# EAGLE design rcl_mini_v0.1 (EAGLE 8.0.1)
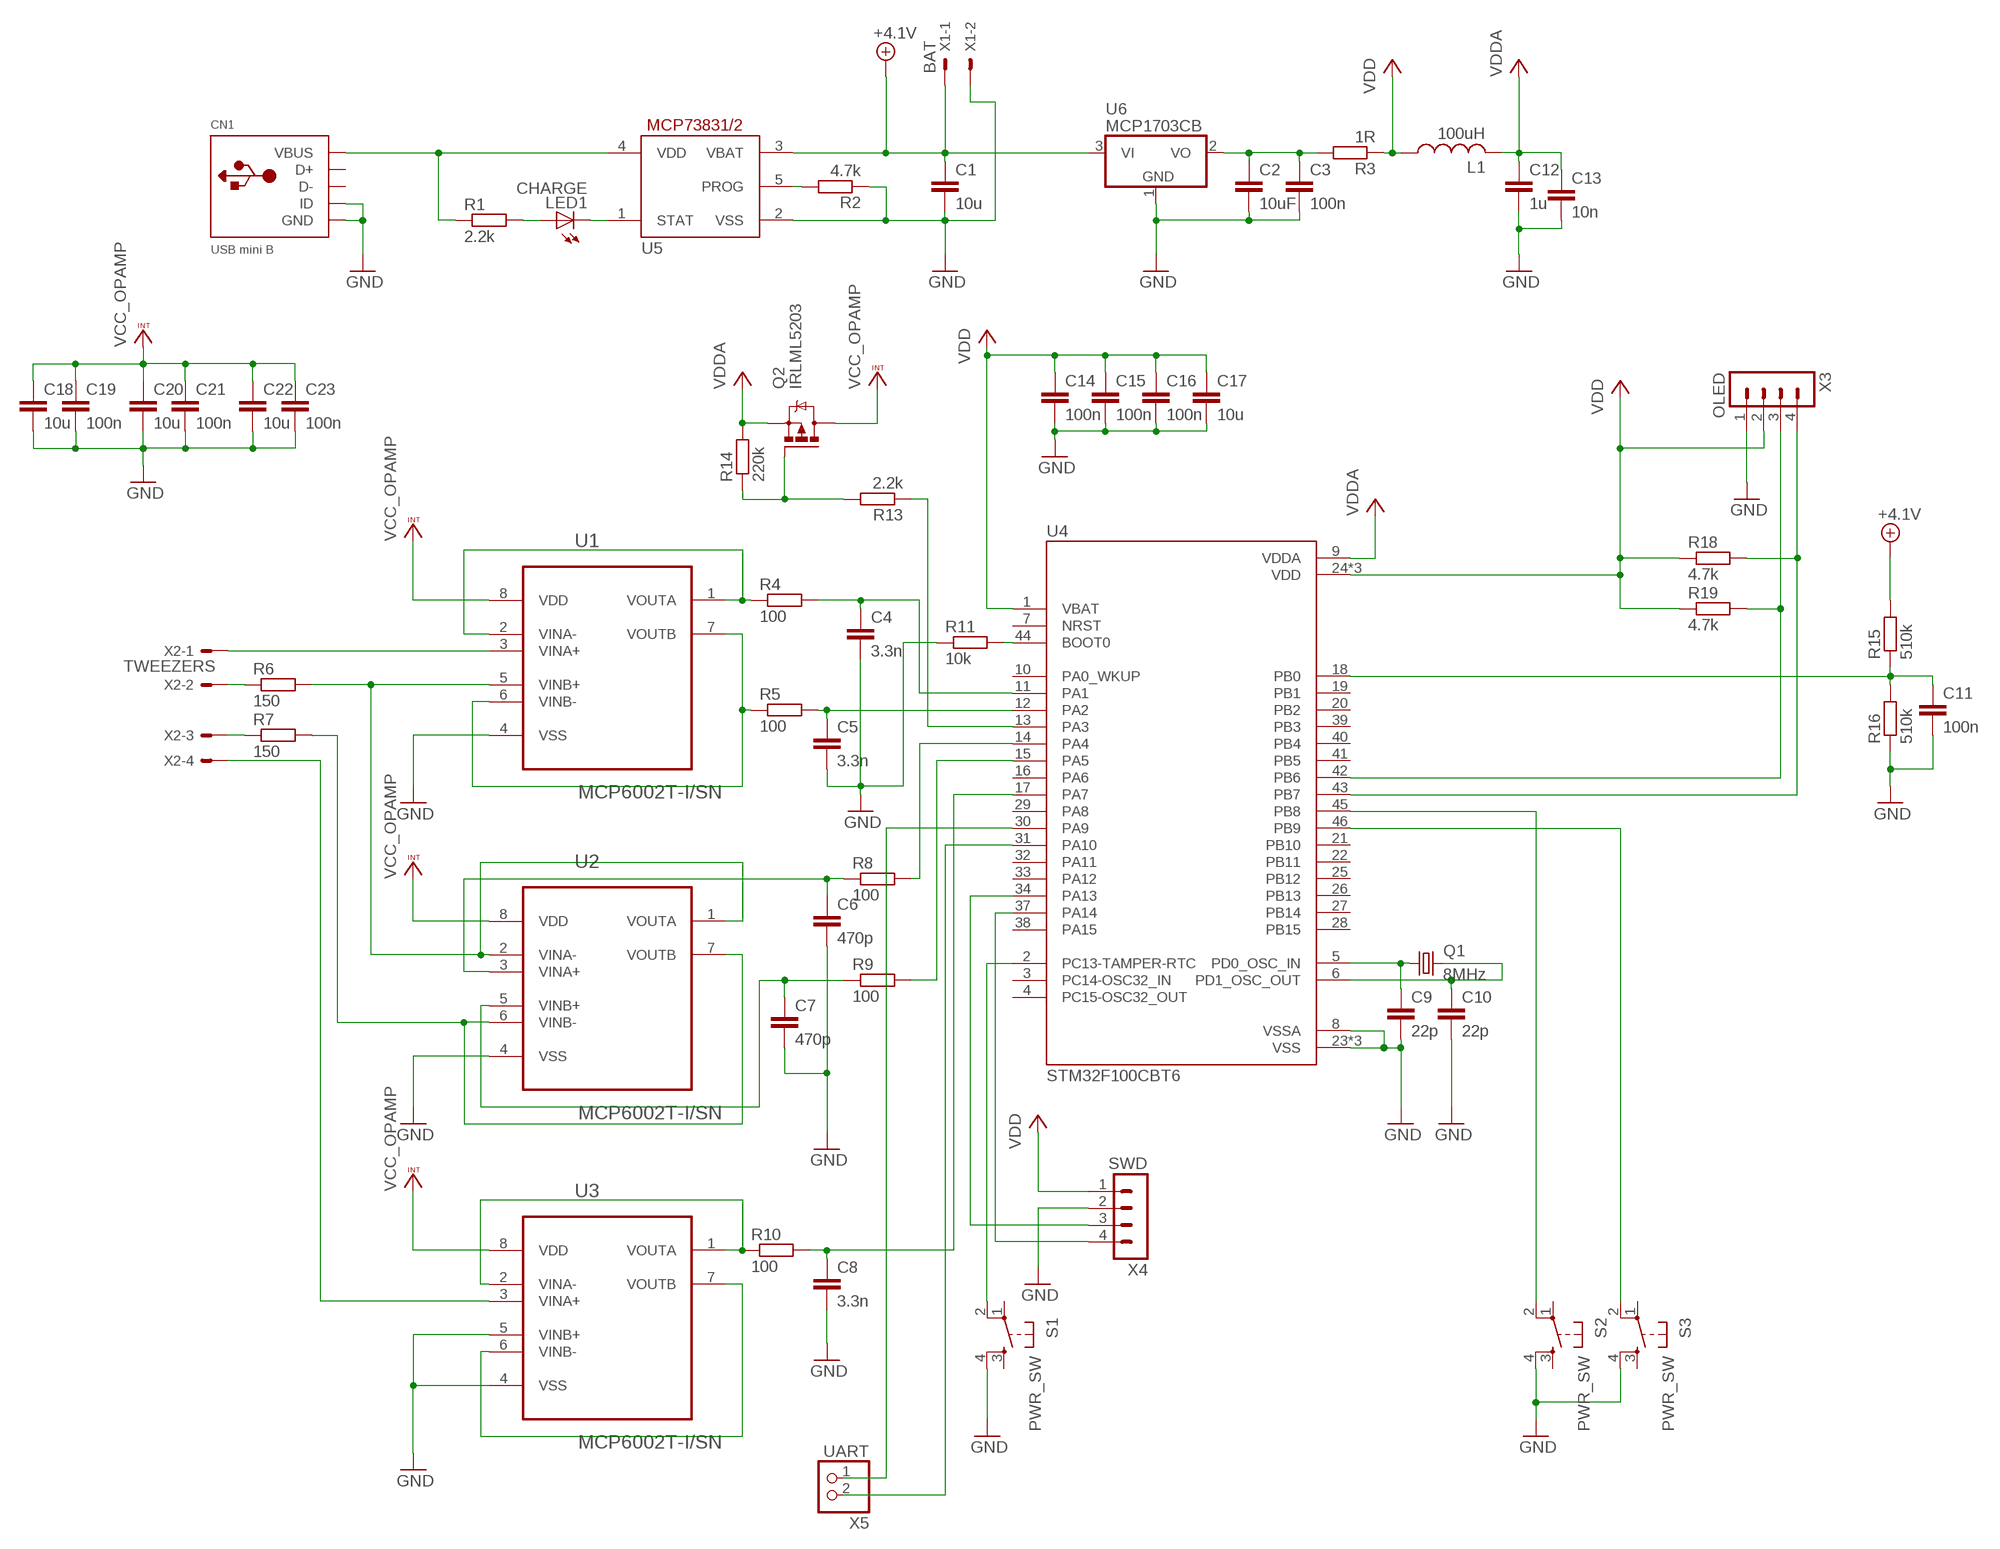
[diagram p0: schematic, sheet 1]

## Parts
C1  10u  C-EUC0805  [C0805]
C2  10uF  C-EUC0805  [C0805]
C3  100n  C-EUC0805  [C0805]
C4  3.3n  C-EUC0805  [C0805]
C5  3.3n  C-EUC0805  [C0805]
C6  470p  C-EUC0805  [C0805]
C7  470p  C-EUC0805  [C0805]
C8  3.3n  C-EUC0805  [C0805]
C9  22p  C-EUC0805  [C0805]
C10  22p  C-EUC0805  [C0805]
C11  100n  C-EUC0805  [C0805]
C12  1u  C-EUC0805  [C0805]
C13  10n  C-EUC0805  [C0805]
C14  100n  C-EUC0805  [C0805]
C15  100n  C-EUC0805  [C0805]
C16  100n  C-EUC0805  [C0805]
C17  10u  C-EUC0805  [C0805]
C18  10u  C-EUC0805  [C0805]
C19  100n  C-EUC0805  [C0805]
C20  10u  C-EUC0805  [C0805]
C21  100n  C-EUC0805  [C0805]
C22  10u  C-EUC0805  [C0805]
C23  100n  C-EUC0805  [C0805]
CN1  USB mini B  USBMINIB  [USB-MINIB]
L1  100uH  L-USL3216C  [L3216C]
LED1  CHARGE  LEDCHIPLED_1206  [CHIPLED_1206]
Q1  8MHz  CRYSTALHC49UP  [HC49UP]
Q2  IRLML5203  [MICRO3]
R1  2.2k  R-EU_M0805  [M0805]
R2  4.7k  R-EU_M0805  [M0805]
R3  1R  R-EU_M0805  [M0805]
R4  100  R-EU_M0805  [M0805]
R5  100  R-EU_M0805  [M0805]
R6  150  R-EU_M0805  [M0805]
R7  150  R-EU_M0805  [M0805]
R8  100  R-EU_M0805  [M0805]
R9  100  R-EU_M0805  [M0805]
R10  100  R-EU_M0805  [M0805]
R11  10k  R-EU_M0805  [M0805]
R13  2.2k  R-EU_M0805  [M0805]
R14  220k  R-EU_M0805  [M0805]
R15  510k  R-EU_M0805  [M0805]
R16  510k  R-EU_M0805  [M0805]
R18  4.7k  R-EU_M0805  [M0805]
R19  4.7k  R-EU_M0805  [M0805]
S1  PWR_SW  DTS-6  [DTS-6]
S2  PWR_SW  DTS-6  [DTS-6]
S3  PWR_SW  DTS-6  [DTS-6]
U1  MCP6002T-I/SN  MCP6002T-I/MS  [SOP65P490X110-8N]
U2  MCP6002T-I/SN  MCP6002T-I/MS  [SOP65P490X110-8N]
U3  MCP6002T-I/SN  MCP6002T-I/MS  [SOP65P490X110-8N]
U4  STM32F100CBT6  STM32F103C8T6  [QFP50P900X900X160-48N]
U5  MCP73831/OT  [SOT23-5L]
U6  MCP1703CB  [SOT23]
UART  X5  PINHD-1X2  [1X02]
X1  BAT  22-23-2021  [22-23-2021]
X2  TWEEZERS  22-23-2041  [22-23-2041]
X3  OLED  MA04-1  [MA04-1]
X4  SWD  MA04-1  [MA04-1]

## Nets
GND [power]: C1.2 C2.2 C3.2 C4.2 C5.2 C6.2 C7.2 C8.2 C9.2 C10.2 C11.2 C12.2 C13.2 C14.2 C15.2 C16.2 C17.2 C18.2 C19.2 C20.2 C21.2 C22.2 C23.2 CN1.GND CN1.ID R2.1 R11.1 R16.1 S1.4 S2.4 S3.4 U1.4(VSS) U2.4(VSS) U3.4(VSS) U3.5(VINB+) U4.8(VSSA) U4.23(VSS) U4.35(VSS) U4.47(VSS) U5.2(VSS) U6.1(GND) X1.2 X3.1 X4.2
HCUR: R7.1 X2.3
HCUR2: R7.2 U2.6(VINB-) U2.7(VOUTB)
HPOT: U3.3(VINA+) X2.4
LCUR: R6.1 X2.2
LCUR2: R6.2 U1.5(VINB+) U2.1(VOUTA) U2.2(VINA-)
LPOT: U1.3(VINA+) X2.1
N$2: LED1.A R1.2
N$3: LED1.C U5.1(STAT)
N$4: R2.2 U5.5(PROG)
N$5: C2.1 C3.1 R3.2 U6.2(VO)
N$6: R4.1 U1.1(VOUTA) U1.2(VINA-)
N$10: R5.1 U1.6(VINB-) U1.7(VOUTB)
N$11: C6.1 R8.1 U2.3(VINA+)
N$12: R11.2 U4.44(BOOT0)
N$15: Q2.1(G) R13.2 R14.1
N$16: C7.1 R9.1 U2.5(VINB+)
N$19: R10.1 U3.1(VOUTA) U3.2(VINA-)
N$20: C11.1 R15.1 R16.2 U4.18(PB0)
N$21: U3.6(VINB-) U3.7(VOUTB)
N$23: C9.1 Q1.1 U4.5(PD0_OSC_IN)
N$24: C10.1 Q1.2 U4.6(PD1_OSC_OUT)
OLED_I2C_SCK: R19.2 U4.42(PB6) X3.3
OLED_I2C_SDA: R18.2 U4.43(PB7) X3.4
PA1: C4.1 R4.2 U4.11(PA1)
PA2: C5.1 R5.2 U4.12(PA2)
PA3: R13.1 U4.13(PA3)
PA4: R8.2 U4.14(PA4)
PA5: R9.2 U4.15(PA5)
PA7: C8.1 R10.2 U4.17(PA7)
SW1: S1.2 U4.2(PC13-TAMPER-RTC)
SW2: S2.2 U4.45(PB8)
SW3: S3.2 U4.46(PB9)
SWCLK: U4.37(PA14) X4.4
SWDIO: U4.34(PA13) X4.3
UART_RX: U4.31(PA10) UART.2
UART_TX: U4.30(PA9) UART.1
USB+: CN1.VBUS R1.1 U5.4(VDD)
VBAT+: C1.1 R15.2 U5.3(VBAT) U6.3(VI) X1.1 ; supply symbol labelled +4.1V
VCC_OPAMP [power]: C18.1 C19.1 C20.1 C21.1 C22.1 C23.1 Q2.3(D) U1.8(VDD) U2.8(VDD) U3.8(VDD)
VDD: C14.1 C15.1 C16.1 C17.1 L1.1 R3.1 R18.1 R19.1 U4.1(VBAT) U4.24(VDD) U4.36(VDD) U4.48(VDD) X3.2 X4.1
VDDA: C12.1 C13.1 L1.2 Q2.2(S) R14.2 U4.9(VDDA)
Unconnected: CN1.D+ CN1.D- S1.1 S1.3 S2.1 S2.3 S3.1 S3.3 U4.3(PC14-OSC32_IN) U4.4(PC15-OSC32_OUT) U4.7(NRST) U4.10(PA0_WKUP) U4.16(PA6) U4.19(PB1) U4.20(PB2) U4.21(PB10) U4.22(PB11) U4.25(PB12) U4.26(PB13) U4.27(PB14) U4.28(PB15) U4.29(PA8) U4.32(PA11) U4.33(PA12) U4.38(PA15) U4.39(PB3) U4.40(PB4) U4.41(PB5)

## Library data of the parts
C1-C23 = rcl:C-EU: CAPACITOR, European symbol
CN1 = adafruit:USB: USB Connectors USBMINIB - Surface Mount Female Mini-B USB Connector 4UConnector: 06564 By microbuilder.eu Thru-hole RA Female Mini-B USB Connector 4UConnector: 18732 By ladyada.net
L1 = rcl:L-US: INDUCTOR, American symbol
LED1 = led:LED: LED OSRAM: - CHIPLED LG R971, LG N971, LY N971, LG Q971, LY Q971, LO R971, LY R971 LH N974, LH R974 LS Q976, LO Q976, LY Q976 LO Q996 - Hyper CHIPLED LW Q18S LB Q993, LB Q99A, LB R99A - SideLED LS A670, LO A670, LY A670, LG A670, LP A670 LB A673, LV A673, LT A673, LW A673 LH A674 LY A675 LS A676, LA A676, LO A676, LY A676, LW A676 LS A679, LY A679, LG A679 - Hyper Micro SIDELED® LS Y876, LA Y876, LO Y876, LY Y876 LT Y87S - SmartLED LW L88C, LW L88S LB L89C, LB L89S, LG L890 LS L89K, LO L89K, LY L89K LS L896, LA L896, LO L896, LY L896 - TOPLED LS T670, LO T670, LY T670, LG T670, LP T670 LSG T670, LSP T670, LSY T670, LOP T670, LYG T670 LG T671, LOG T671, LSG T671 LB T673, LV T673, LT T673, LW T673 LH T674 LS T676, LA T676, LO T676, LY T676, LB T676, LH T676, LSB T676, LW T676 LB T67C, LV T67C, LT T67C, LS T67K, LO T67K, LY T67K, LW E67C LS E67B, LA E67B, LO E67B, LY E67B, LB E67C, LV E67C, LT E67C LW T67C LS T679, LY T679, LG T679 LS T770, LO T770, LY T770, LG T770, LP T770 LB T773, LV T773, LT T773, LW T773 LH T774 LS E675, LA E675, LY E675, LS T675 LS T776, LA T776, LO T776, LY T776, LB T776 LHGB T686 LT T68C, LB T68C - Hyper Mini TOPLED® LB M676 - Mini TOPLED Santana® LG M470 LS M47K, LO M47K, LY M47K Source: http://www.osram.convergy.de LUXEON: - LUMILED® LXK2-PW12-R00, LXK2-PW12-S00, LXK2-PW14-U00, LXK2-PW14-V00 LXK2-PM12-R00, LXK2-PM12-S00, LXK2-PM14-U00 LXK2-PE12-Q00, LXK2-PE12-R00, LXK2-PE12-S00, LXK2-PE14-T00, LXK2-PE14-U00 LXK2-PB12-K00, LXK2-PB12-L00, LXK2-PB12-M00, LXK2-PB14-N00, LXK2-PB14-P00, LXK2-PB14-Q00 LXK2-PR12-L00, LXK2-PR12-M00, LXK2-PR14-Q00, LXK2-PR14-R00 LXK2-PD12-Q00, LXK2-PD12-R00, LXK2-PD12-S00 LXK2-PH12-R00, LXK2-PH12-S00 LXK2-PL12-P00, LXK2-PL12-Q00, LXK2-PL12-R00 Source: www.luxeon.com KINGBRIGHT: KA-3528ASYC Source: www.kingbright.com
Q1 = adafruit:CRYSTAL: CRYSTAL; OC_FARNELL: unknown; OC_NEWARK: unknown
Q2 = transistor-power:IRLML5203: HEXFET P-Channel Power MOSFET
R1-R11 R13-R16 R18 R19 = rcl:R-EU_: RESISTOR, European symbol
S1-S3 = switch-tact:DTS-6
U1-U3 = MCP6002T:MCP6002T-I/MS: Low-Power Op Amp; AVAILABILITY: Unavailable; DESCRIPTION: MCP6002 Series 6 V 1 MHz 0.6 V/us SMT Low-Power Operational Amplifier - MSOP-8; MF: Microchip; MP: MCP6002T-I/MS; PACKAGE: MSOP-8 Microchip; PRICE: None
U4 = STM32F10xCx:STM32F103C8T6: Mainstream Performance line, ARM Cortex-M3 MCU with 64 Kbytes Flash, 72 MHz CPU, motor control, USB and CAN; AVAILABILITY: Unavailable; DESCRIPTION: Mainstream Performance line, ARM Cortex-M3 MCU with 64 Kbytes Flash, 72 MHz CPU, motor control, USB and CAN; MF: STMicroelectronics; MP: STM32F103C8T6; PACKAGE: LQFP-48 STMicroelectronics; PRICE: None
U5 = adafruit:MCP73831: MCP73831/2 Miniature Single-Cell, Fully Integrated Li-Ion, Li-Polymer Charge Management Controllers. Nice and small simple lipoly charge controller, with adjustable current and status output (LED) http://www.ladyada.net/library/pcb/eaglelibrary.html
U6 = linear:MCP1703: 250 mA, 16V, Low Quiescent Current LDO Regulator Source: http://ww1.microchip.com/downloads/en/DeviceDoc/22049b.pdf
UART = pinhead:PINHD-1X2: PIN HEADER
X1 = con-molex:22-23-2021: .100" (2.54mm) Center Header - 2 Pin; MF: MOLEX; MPN: 22-23-2021; OC_FARNELL: 1462926; OC_NEWARK: 25C3832
X2 = con-molex:22-23-2041: .100" (2.54mm) Center Header - 4 Pin; MF: MOLEX; MPN: 22-23-2041; OC_FARNELL: 1462920; OC_NEWARK: 38C0355
X3 X4 = con-lstb:MA04-1: PIN HEADER; OC_FARNELL: unknown; OC_NEWARK: unknown

## Net classes
0 default: width 0.4 mm
1 power: width 0.6 mm

## Board
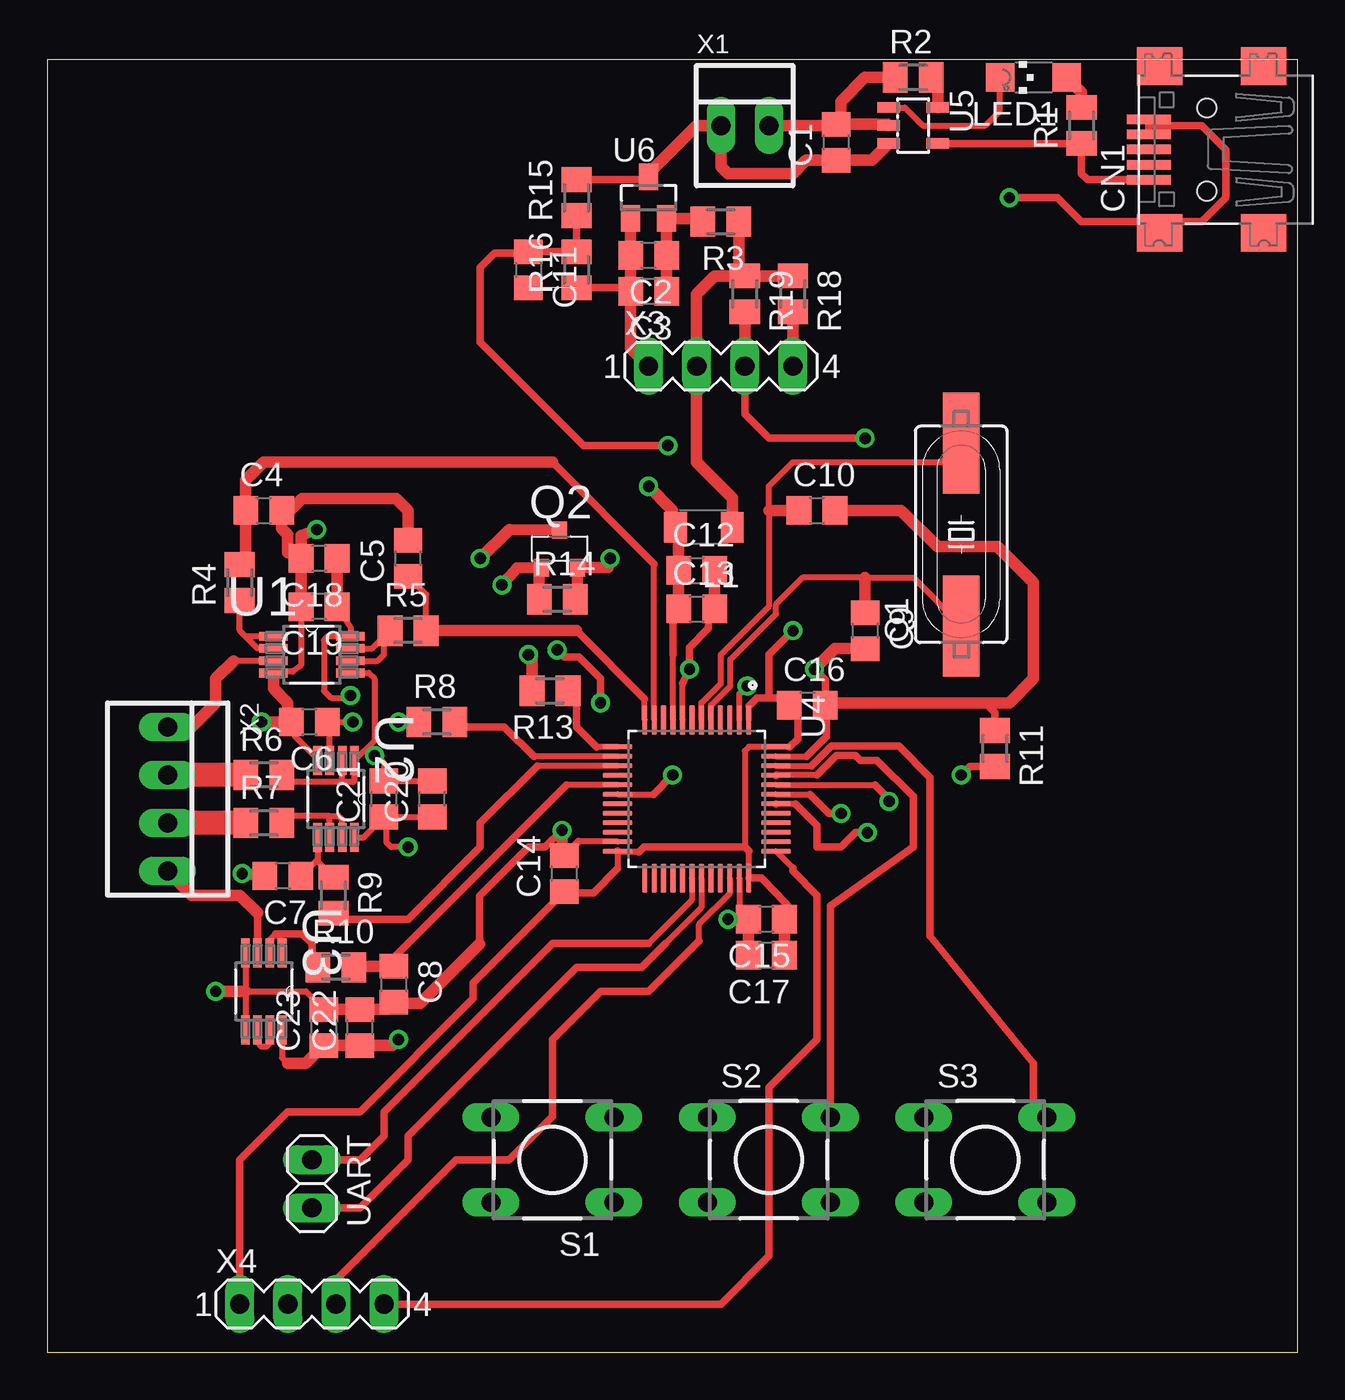
[diagram p1: board, top side]
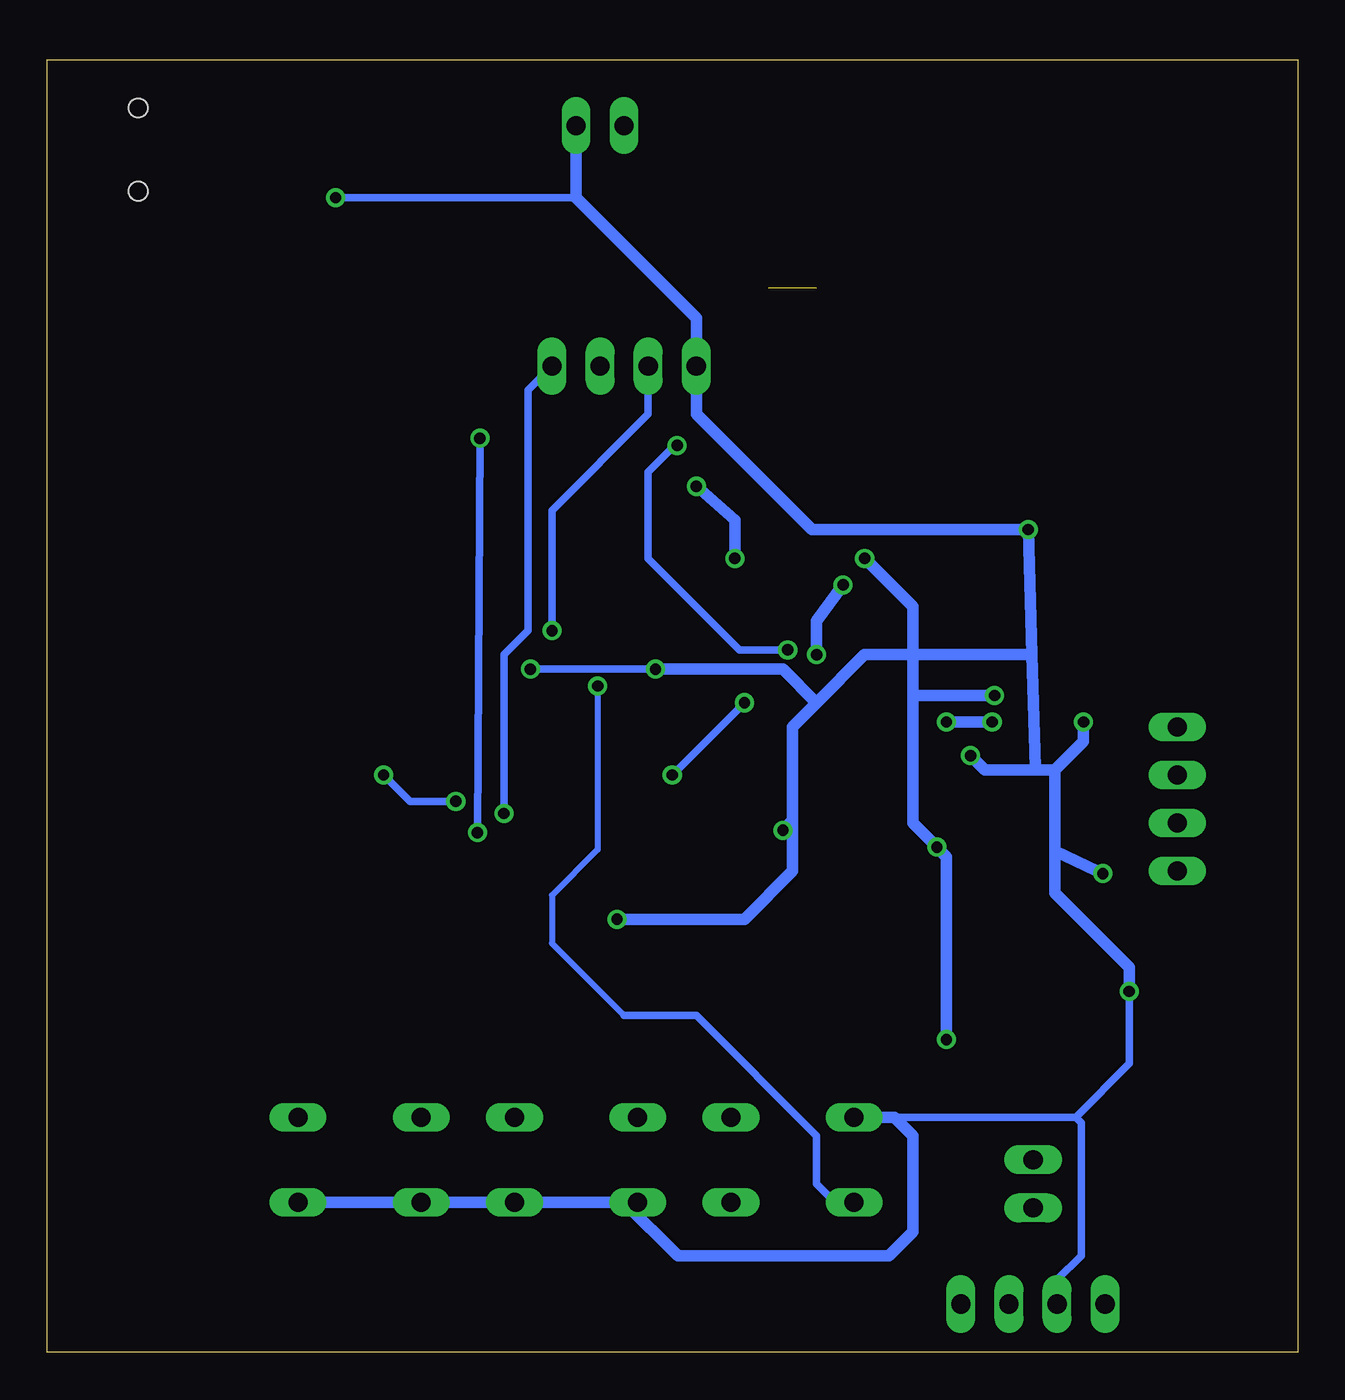
[diagram p2: board, bottom side, seen from below]

Size 66.02 x 68.25 mm. Coordinates in mm from the lower left corner, seen from the top.
Outline: 0,0 66.02,0 66.02,68.25 0,68.25 0,0
Copper layers (1*16): Top 0.035mm / dielectric 1.5mm / Bottom 0.035mm
Design rules "default": minimum track width 10mil, minimum drill 24mil, track to track 8mil, track to pad 8mil, pad to pad 8mil, via to via 8mil, smd to smd 8mil, copper to edge 40mil, drill to drill 8mil, minimum pad ring 10mil, minimum via ring 8mil, stop-mask expansion 4mil, vias tented up to drill 0mil, thermal gap 10mil

### Footprints (pad centres in the part's own frame; a part is rotated, then mirrored left to right if it is on the bottom)
C0805 = smd 1.3 x 1.5: 1 -0.95,0; 2 0.95,0
USB-MINIB = smd 0.5 x 2.308: D+ 0,4.064; D- -0.8,4.064; GND 1.6,4.064; ID 0.8,4.064; VBUS -1.6,4.064 | smd 2 x 2.4: GND1 -4.4,-2; GND2 -4.4,3.5; GND3 4.4,3.5; GND4 4.4,-2 | hole 1: -2.2,1; 2.2,1
L3216C = smd 1.2 x 1.6: 1 -1.5,0; 2 1.5,0
CHIPLED_1206 = smd 1.5 x 1.5: A 0,-1.75; C 0,1.75
HC49UP = smd 5.334 x 1.93: 1 -4.826,0; 2 4.826,0
MICRO3 = smd 0.8 x 0.9: 1 -0.95,-1; 2 0.95,-1; 3 0,1
M0805 = smd 1.3 x 1.6: 1 -0.95,0; 2 0.95,0
DTS-6 = drill 1 long: 1 -3.25,2.25; 2 3.25,2.25; 3 -3.25,-2.25; 4 3.25,-2.25
SOP65P490X110-8N = smd 1.524 x 0.457: 1 -2.032,0.965; 2 -2.032,0.33; 3 -2.032,-0.33; 4 -2.032,-0.965; 5 2.032,-0.965; 6 2.032,-0.33; 7 2.032,0.33; 8 2.032,0.965
QFP50P900X900X160-48N = smd 1.56 x 0.28: 1 -4.18,2.75; 2 -4.18,2.25; 3 -4.18,1.75; 4 -4.18,1.25; 5 -4.18,0.75; 6 -4.18,0.25; 7 -4.18,-0.25; 8 -4.18,-0.75; 9 -4.18,-1.25; 10 -4.18,-1.75; 11 -4.18,-2.25; 12 -4.18,-2.75; 25 4.18,-2.75; 26 4.18,-2.25; 27 4.18,-1.75; 28 4.18,-1.25; 29 4.18,-0.75; 30 4.18,-0.25; 31 4.18,0.25; 32 4.18,0.75; 33 4.18,1.25; 34 4.18,1.75; 35 4.18,2.25; 36 4.18,2.75 | smd 0.28 x 1.56: 13 -2.75,-4.18; 14 -2.25,-4.18; 15 -1.75,-4.18; 16 -1.25,-4.18; 17 -0.75,-4.18; 18 -0.25,-4.18; 19 0.25,-4.18; 20 0.75,-4.18; 21 1.25,-4.18; 22 1.75,-4.18; 23 2.25,-4.18; 24 2.75,-4.18; 37 2.75,4.18; 38 2.25,4.18; 39 1.75,4.18; 40 1.25,4.18; 41 0.75,4.18; 42 0.25,4.18; 43 -0.25,4.18; 44 -0.75,4.18; 45 -1.25,4.18; 46 -1.75,4.18; 47 -2.25,4.18; 48 -2.75,4.18
SOT23-5L = smd 0.55 x 1.2: 1 -0.95,-1.3; 2 0,-1.3; 3 0.95,-1.3; 4 0.95,1.3; 5 -0.95,1.3
SOT23 = smd 1 x 1.4: 1 -0.95,-1.1; 2 0.95,-1.1; 3 0,1.1
1X02 = drill 1.016 long: 1 -1.27,0; 2 1.27,0
22-23-2021 = drill 1 long: 1 -1.27,0; 2 1.27,0
22-23-2041 = drill 1 long: 1 -3.81,0; 2 -1.27,0; 3 1.27,0; 4 3.81,0
MA04-1 = drill 1.016 long: 1 -3.81,0; 2 -1.27,0; 3 1.27,0; 4 3.81,0

### Placement (x,y rotation side)
C1  41.66,63.88 90 top
C2  31.75,57.91 180 top
C3  31.75,56.01 180 top
C4  11.43,44.45 0 top
C5  19.05,41.91 90 top
C6  13.84,33.27 180 top
C7  12.45,25.15 180 top
C8  18.29,19.43 270 top
C9  43.18,38.1 270 top
C10  40.64,44.45 0 top
C11  25.4,57.15 270 top
C12  34.29,41.28 0 top
C13  34.29,39.24 0 top
C14  27.3,25.27 90 top
C15  37.97,22.86 180 top
C16  40.13,34.16 0 top
C17  37.97,20.95 180 top
C18  14.35,41.91 180 top
C19  14.35,39.37 180 top
C20  20.32,29.21 90 top
C21  17.78,29.21 90 top
C22  16.51,17.15 90 top
C23  14.6,17.15 90 top
CN1  62.23,63.5 90 top
L1  34.67,43.56 180 top
LED1  52.07,67.31 90 top
Q1  48.26,43.18 90 top
Q2  27.05,42.42 0 top
R1  54.61,64.77 90 top
R2  45.72,67.31 0 top
R3  35.56,59.69 180 top
R4  10.16,40.64 90 top
R5  19.05,38.1 0 top
R6  11.43,30.48 0 top
R7  11.43,27.94 0 top
R8  20.57,33.27 0 top
R9  15.11,24.13 270 top
R10  15.24,20.32 0 top
R11  50.04,31.88 270 top
R13  26.54,34.92 180 top
R14  26.92,39.75 0 top
R15  27.94,60.96 90 top
R16  27.94,57.15 90 top
R18  39.37,55.88 270 top
R19  36.83,55.88 270 top
S1  26.67,10.16 180 top
S2  38.1,10.16 0 top
S3  49.53,10.16 0 top
U1  13.97,36.83 0 top
U2  15.24,29.21 270 top
U3  11.43,19.05 270 top
U4  34.29,29.21 270 top
U5  45.72,64.77 270 top
U6  31.75,60.96 0 top
UART  13.97,8.89 270 top
X1  36.83,64.77 0 top
X2  6.35,29.21 270 top
X3  35.56,52.07 0 top
X4  13.97,2.54 0 top

### Tracks (layer width: path | path; a pad name or v marks a point on that pad's centre or on a via)
GND  (via drill 0.6)  (1 unrouted)
  Top 0.305: U2.4 14.28,31.32 13.08,32.51 13.08,33.09 C6.2 12.7,33.47 | C19.2 13.4,36.26 12.95,35.94 12.01,35.94 U1.4 | 17.46,30.16 C21.2 | C8.2 17.9,18.09 | U3.4 10.46,19.05 | 10.46,19.05 U3.5 | 10.46,19.05 13.65,19.05 C23.2 | v17.27,31.5 17.4,31.5 17.78,31.12 C21.2 | C21.2 C20.2 | C4.2 12.83,44.45 | U4.47 40.1,31.46 | U4.35 36.54,23.01 | U4.23 28.04,26.96 | U4.8 33.54,35.32
  Top 0.406: 40.1,31.46 41.15,32.51 41.15,34.1 C16.2 41.08,35.5 v40.51,36.07 | C15.2 36.54,23.01 | 28.04,26.96 C14.2 | 33.54,35.32 v33.91,36.07 33.91,37.21 34.92,38.23 34.92,39.05 C13.2 | R16.1 30.61,56.2 C3.2 | R11.1 50.04,33.78 49.53,34.29 | CN1.ID CN1.GND 58.5,64.77 60.96,64.77 62.23,63.5 62.23,60.96 60.96,59.69 54.61,59.69 53.34,60.96 v50.8,60.96 | 22.82,21.55 22.82,24.09 25.4,26.67 26.29,26.67 v27.18,27.56
  Top 0.61: U1.4 11.94,35.05 12.7,34.29 12.7,33.47 | C19.2 C18.2 | C4.2 12.38,43.5 12.7,43.18 12.7,42.23 C18.2 | C23.2 C22.2 17.9,18.09 | C6.2 v11.3,33.27 | C18.2 13.4,43.12 v14.22,43.43 | v10.29,25.27 C7.2 | v8.89,19.05 10.46,19.05 | 12.83,44.45 13.46,45.08 18.42,45.08 19.05,44.45 C5.2 | v27.18,27.56 27.18,26.35 C14.2 | v35.94,22.86 C15.2 C17.2 | C13.2 C12.2 | C9.2 41.59,37.15 v40.51,36.07 | C10.2 45.09,44.45 46.99,42.55 50.16,42.55 52.07,40.64 52.07,35.56 50.8,34.29 49.53,34.29 41.21,34.29 C16.2 | U6.1 C2.2 C3.2 30.8,53.02 X3.1 | X1.2 41.59,64.77 C1.2 | C1.2 44.36,64.83 U5.2 | R2.1 43.18,67.31 41.91,66.04 41.91,65.08 C1.2 | C8.2 18.35,18.41 19.69,18.41 22.82,21.55
  Bottom 0.305: 13.84,30.86 13.97,30.73
  Bottom 0.406: v40.51,36.07 v33.91,36.07 | 11.72,12.41 S1.4 | 11.72,12.41 8.89,15.24 v8.89,19.05 | X4.2 12.7,3.81 11.43,5.08 11.43,12.12 11.72,12.41 | 38.1,60.96 v50.8,60.96
  Bottom 0.61: v11.3,33.27 11.3,32.26 12.83,30.73 | 12.83,30.73 13.97,30.73 16.51,30.73 v17.27,31.5 | 14.02,36.83 v14.22,43.43 25.65,43.43 31.75,49.53 X3.1 31.75,54.61 38.1,60.96 X1.2 | 14.02,36.83 13.84,30.86 | 12.83,30.73 12.83,26.48 | 12.83,26.48 10.61,25.4 v10.29,25.27 | 12.83,26.48 12.83,24.26 8.89,20.32 v8.89,19.05 | 14.02,36.83 22.86,36.83 25.4,34.29 | 25.4,34.29 26.67,33.02 26.67,28.07 | 26.67,28.07 v27.18,27.56 | 26.67,28.07 26.67,25.4 29.21,22.86 v35.94,22.86 | v33.91,36.07 27.18,36.07 25.4,34.29 | 35.56,7.91 S2.4 S3.4 | 35.56,7.91 35.02,7.91 34.92,8 | S1.4 21.3,12.41 20.32,11.43 20.32,6.35 21.59,5.08 32.73,5.08 35.56,7.91
HCUR
  Top 1.27: R7.1 X2.3
HCUR2
  Top 0.305: U2.7 15.57,28.12 15.37,28.32 14.86,28.32 | 14.86,28.32 12.76,28.32 R7.2 | U2.6 14.91,28.27 14.86,28.32
HPOT
  Top 0.406: U3.3 11.1,23.19
  Top 0.61: 11.1,23.19 10.16,24.13 7.62,24.13 X2.4
LCUR
  Top 0.305: X2.2 5.08,30.48
  Top 1.27: R6.1 X2.2
LCUR2
  Top 0.305: 15.57,30.17 U2.2 | 15.57,30.17 15.49,30.1 12.76,30.1 R6.2 | 15.57,30.17 15.65,30.1 16.13,30.1 16.21,30.17 U2.1 17.27,32.31 17.27,35.56 16.97,35.86 U1.5
LPOT
  Top 0.305: U1.3 9.83,36.5
  Top 0.61: 9.83,36.5 8.89,35.56 8.89,34.29 7.62,33.02 X2.1
N$2
  Top 0.61: R1.2 54.61,66.52 LED1.A
N$3
  Top 0.305: U5.1 45.28,65.72 46.23,64.77 49.53,64.77 50.29,65.53 50.29,67.28 LED1.C
N$4
  Top 0.61: U5.5 47.02,66.96 R2.2
N$5
  Top 0.61: R3.2 34.44,59.86 U6.2 C2.1 C3.1
N$6
  Top 0.305: U1.2 11.1,37.16 10.16,38.1 | 10.16,38.1 R4.1 | U1.1 10.46,37.8 10.16,38.1
N$7
  Top 0.61: 39.37,54.61 39.37,55.12
N$10
  Top 0.305: U1.7 17.16,37.16 R5.1 17.78,37.78 17.78,36.83 17.45,36.5 U1.6
N$11  (via drill 0.6)
  Top 0.305: U2.3 14.91,33.16 C6.1 v16.13,33.27 | v18.54,33.27 R8.1
  Bottom 0.61: v16.13,33.27 v18.54,33.27
N$12  (via drill 0.6)
  Top 0.305: U4.44 43.7,29.96
  Top 0.406: 43.7,29.96 44.45,29.21 v44.45,29.08 | R11.2 48.71,30.93 v48.26,30.48
  Bottom 0.406: v44.45,29.08 46.86,29.08 v48.26,30.48
N$15  (via drill 0.6)
  Top 0.61: R13.2 25.59,36.64 v25.4,36.83 | v24,40.51 24.82,41.4 Q2.1 25.97,41.29 R14.1
  Bottom 0.61: v25.4,36.83 25.4,38.61 v24,40.51
N$16
  Top 0.305: U2.5 14.28,26.02 | 14.28,26.02 C7.1 | 14.28,26.02 14.28,25.92 R9.1
N$19
  Top 0.305: U3.2 11.76,21.79 12.06,22.1 12.39,21.77 U3.1 | 13.97,20.64 R10.1
  Top 0.406: 12.06,22.1 13.46,22.1 13.97,21.59 13.97,20.64
N$20  (via drill 0.6)
  Top 0.305: U4.18 32,29.46
  Top 0.406: 32,29.46 v33.02,30.48 | v29.21,34.29 29.21,35.56 28.07,36.7 27.3,36.7 v26.92,37.08 | v32.77,47.88 28.32,47.88 22.86,53.34 22.86,57.28 23.62,58.04 25.34,58.04 C11.1 R16.2 R15.1
  Bottom 0.406: v33.02,30.48 v29.21,34.29 | v26.92,37.08 29.46,37.08 34.29,41.91 34.29,46.48 32.77,48.01 v32.77,47.88
N$21
  Top 0.305: U3.7 11.76,16.33 11.56,16.13 11.3,16.13 11.05,16.38 11.05,16.97 U3.6
N$23
  Top 0.305: U4.5 35.04,34.15 36.07,35.18 36.07,36.58 38.48,38.99 38.48,39.5 39.88,40.89 43.18,40.89 45.72,40.89 Q1.1
  Top 0.61: C9.1 43.18,40.89
N$24
  Top 0.305: U4.6 34.54,34.29 35.56,35.31 35.56,36.83 38.1,39.37 38.1,44.45 38.1,45.72 39.37,46.99 47.24,46.99 Q1.2
  Top 0.61: C10.1 38.1,44.45
OLED_I2C_SCK  (via drill 0.6)
  Top 0.305: 39.5,28.96 U4.42
  Top 0.406: v43.18,48.26 38.1,48.26 36.83,49.53 X3.3 | v43.31,27.43 42.67,27.43 41.91,26.67 40.64,26.67 40.64,27.81 39.5,28.96 | U4.42
  Top 0.61: X3.3 R19.2
  Bottom 0.406: v43.31,27.43 v43.18,48.26
OLED_I2C_SDA  (via drill 0.6)
  Top 0.305: U4.43 40.26,29.46
  Top 0.406: 40.26,29.46 41.27,28.45 v41.91,28.45
  Top 0.61: R18.2 X3.4
  Bottom 0.406: v41.91,28.45 41.91,36.83 40.64,38.1 40.64,50.8 X3.4
PA1
  Top 0.305: 10.48,41.91 R4.2 | U4.11 32.04,41.62
  Top 0.406: 32.04,41.62 26.67,46.99
  Top 0.61: 10.48,41.91 C4.1 10.48,46.04 11.43,46.99 24.13,46.99 26.67,46.99
PA2
  Top 0.305: R5.2 20,40.01 C5.1 | U4.12 31.54,34.5
  Top 0.406: 31.54,34.5 27.94,38.1
  Top 0.61: 27.94,38.1 R5.2
PA3
  Top 0.305: U4.13 29,31.96
  Top 0.406: 29,31.96 27.94,33.02 27.94,34.48 R13.1
PA4
  Top 0.305: U4.14 25.69,31.46
  Top 0.406: 25.69,31.46 24.13,33.02 21.78,33.02 R8.2
PA5
  Top 0.305: U4.15 25.88,30.96
  Top 0.406: 25.88,30.96 22.86,27.94 22.86,26.67 19.05,22.86 15.43,22.86 R9.2
PA7
  Top 0.305: 16.25,20.38 R10.2 | U4.17 27.42,29.96
  Top 0.406: 27.42,29.96 18.42,20.95 18.35,20.32 C8.1
  Top 0.61: C8.1 16.25,20.38
SW1  (via drill 0.6)
  Top 0.305: U4.2 36.54,34.76 v36.96,35.18
  Bottom 0.305: v36.96,35.18 36.96,26.54 39.37,24.13 39.37,21.59 35.56,17.78
  Bottom 0.406: S1.2 24.42,7.91 25.4,8.89 25.4,11.43 31.75,17.78 35.56,17.78
SW2
  Top 0.305: 40.64,30.48 38.49,30.48
  Top 0.406: S2.2 41.35,23.57 45.72,26.67 45.72,29.34 43.81,31.24 42.93,31.24 42.67,31.5 41.66,31.5 40.64,30.48 | 38.49,30.48 U4.45
SW3
  Top 0.305: U4.46 40.36,30.96
  Top 0.406: S3.2 52.07,13.12 52.07,15.24 46.61,21.97 46.61,30.35 44.96,32 41.4,32 40.36,30.96
SWCLK
  Top 0.305: 39.37,25.56 U4.37
  Top 0.406: X4.4 35.56,2.54 38.1,5.08 38.1,13.97 40.64,16.51 40.64,24.13 39.37,25.4 39.37,25.56
SWDIO
  Top 0.305: U4.34 36.04,24.23 34.42,22.61 34.42,21.72
  Top 0.406: X4.3 15.24,3.81 21.59,10.16 24.38,10.16 26.67,12.45 26.67,16.51 29.21,19.05 31.75,19.05 34.42,21.72
UART_RX
  Top 0.305: U4.31 34.54,23.49 32.64,21.59
  Top 0.406: UART.2 16.51,7.62 19.05,10.16 19.05,11.43 27.94,20.32 31.37,20.32 32.64,21.59
UART_TX
  Top 0.305: U4.30 34.04,23.88 31.75,21.59
  Top 0.406: 31.75,21.59 26.67,21.59 17.78,12.7 17.78,11.43 16.51,10.16 UART.1
USB+
  Top 0.406: CN1.VBUS 54.94,61.9 54.61,62.23 R1.1 U5.4
VBAT+
  Top 0.406: R15.2 31.6,61.91 U6.3
  Top 0.61: 31.92,62.23 U6.3 31.75,62.23 34.29,64.77 X1.1 35.56,62.61 35.94,62.23 39.37,62.23 40.07,62.93 C1.1 43.53,62.93 U5.3
VCC_OPAMP  (via drill 0.6)
  Top 0.305: C19.1 16,38.29 U1.8 14.81,37.8 14.6,37.59 14.6,34.92 14.99,34.54 15.87,34.54 v16,34.67 | U2.8 16.7,27.18 C21.1 | C21.1 C20.1 | U3.8 12.39,15.55 12.7,15.24 | v19.05,26.67 18.16,26.67 17.91,26.92 17.91,28.13 C21.1
  Top 0.61: C19.1 C18.1 | 12.7,15.24 13.65,15.24 C23.1 C22.1 18.23,16.2 v18.54,16.51 | v22.86,41.91 24.4,43.43 Q2.3
  Bottom 0.305: 19.94,34.67 20.32,34.29
  Bottom 0.61: v16,34.67 19.94,34.67 | v18.54,16.51 18.54,26.16 v19.05,26.67 20.32,27.94 20.32,34.29 20.32,39.37 v22.86,41.91
VDD  (via drill 0.6)
  Top 0.305: U4.1 37.04,34.12 | 39.2,31.96 U4.48 37.04,31.96 36.83,31.75 36.83,26.67 | U4.24 30.11,25.54 | U4.36 37.04,26.46 | 31.24,26.42 30.15,26.42
  Top 0.406: 37.04,34.12 37.46,34.54 38.1,34.54 | 38.1,34.54 38.8,34.54 C16.1 39.62,33.72 39.62,32.39 39.2,31.96 | U4.36 37.71,25.03 38.48,24.26 39.24,23.43 C15.1 | 30.11,25.54 28.83,24.26 27.37,24.26 C14.1 22.48,19.5 22.48,18.67 16.51,12.7 12.7,12.7 10.16,10.16 X4.1 | 38.1,34.54 38.1,36.83 v39.37,38.1 | 37.04,26.46 36.83,26.67 31.5,26.67 31.24,26.42 | 30.15,26.42 U4.24
  Top 0.61: C15.1 C17.1 38.99,20.89 | R19.1 R18.1 | R19.1 35.24,56.83 34.29,55.88 X3.2 34.29,46.99 36.17,45.11 L1.1 | R3.1 36.51,57.15 R19.1
  Bottom 0.406: v39.37,38.1 39.37,44.45 34.29,49.53 X3.2
VDDA  (via drill 0.6)
  Top 0.305: U4.9 33.04,36.85
  Top 0.406: 33.04,36.85 33.04,38.94 C13.1
  Top 0.61: C13.1 C12.1 33.34,43.39 L1.2 33.02,43.71 33.02,44.45 v31.75,45.72 | v29.72,41.91 29.61,41.42 Q2.2 28,39.88 R14.2
  Bottom 0.61: v29.72,41.91 29.72,43.94 v31.75,45.72